# EAGLE design IMD_AMS_Latch (EAGLE 9.2.2)
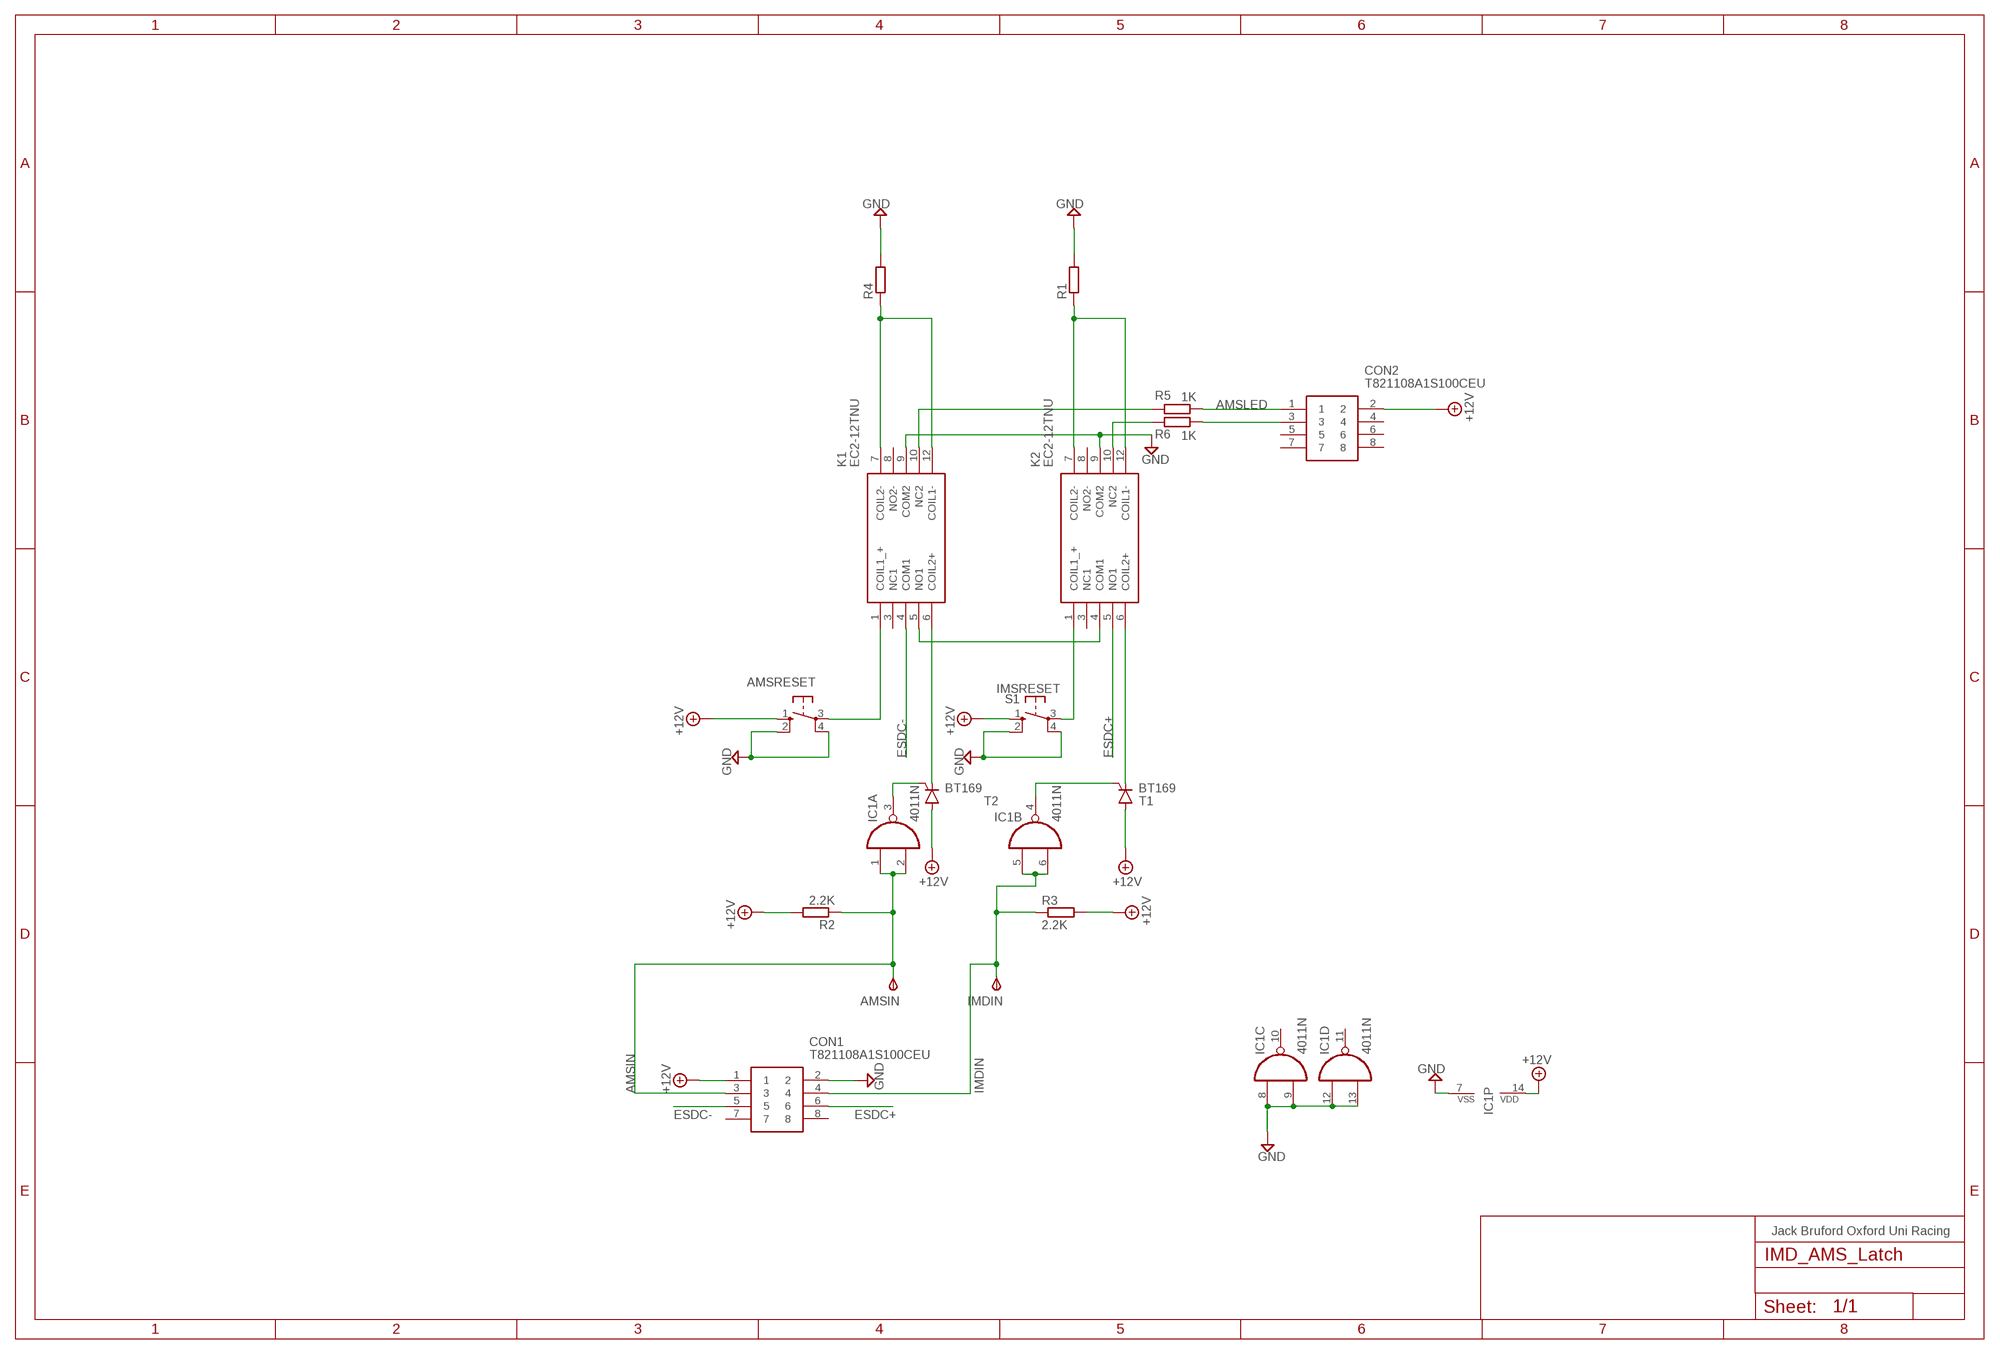
[diagram p0: schematic, sheet 1]

## Parts
AMSIN  TPSPAD1-13  [P1-13]
AMSRESET  10-XX  [B3F-10XX]
CON1  T821108A1S100CEU  [HDRV8W64P254_2X4_1778X895X915P]
CON2  T821108A1S100CEU  [HDRV8W64P254_2X4_1778X895X915P]
IC1  4011N  [DIL14]
IMDIN  TPSPAD1-13  [P1-13]
K1  EC2-12TNU  [EC212TNU]
K2  EC2-12TNU  [EC212TNU]
R1  R-EU_0207/15  [0207/15]
R2  2.2K  R-EU_0207/15  [0207/15]
R3  2.2K  R-EU_0207/15  [0207/15]
R4  R-EU_0207/15  [0207/15]
R5  1K  R-EU_0207/15  [0207/15]
R6  1K  R-EU_0207/15  [0207/15]
S1  10-XX  [B3F-10XX]
T1  BT169  [TO92-2]
T2  BT169  [TO92-2]

## Nets
+12V: AMSRESET.1(S) CON1.1 CON2.2 IC1.14(P:VDD) R2.2 R3.2 S1.1(S) T1.A T2.A
AMSIN: AMSIN.TP(PP) CON1.3 IC1.1(A:I0) IC1.2(A:I1) R2.1
AMSLED: K1.10(NC2) R5.2
ESDC+: CON1.6 K2.5(NO1)
ESDC-: CON1.5 K1.4(COM1)
GND: AMSRESET.2(S1) AMSRESET.4(P1) CON1.2 IC1.7(P:VSS) IC1.8(C:I0) IC1.9(C:I1) IC1.12(D:I0) IC1.13(D:I1) K1.9(COM2) K2.9(COM2) R1.2 R4.2 S1.2(S1) S1.4(P1)
IMDIN: CON1.4 IC1.5(B:I0) IC1.6(B:I1) IMDIN.TP(PP) R3.1
IMSRESET: K1.5(NO1) K2.4(COM1)
N$1: AMSRESET.3(P) K1.1(COIL1_+)
N$2: K1.6(COIL2+) T2.C
N$3: K2.7(COIL2-) K2.12(COIL1-) R1.1
N$4: K2.6(COIL2+) T1.C
N$5: K2.1(COIL1_+) S1.3(P)
N$6: K1.7(COIL2-) K1.12(COIL1-) R4.1
N$7: K2.10(NC2) R6.2
N$8: CON2.1 R5.1
N$9: CON2.3 R6.1
N$10: IC1.3(A:O) T2.G
N$11: IC1.4(B:O) T1.G
Unconnected: CON1.7 CON1.8 CON2.4 CON2.5 CON2.6 CON2.7 CON2.8 IC1.10(C:O) IC1.11(D:O) K1.3(NC1) K1.8(NO2-) K2.3(NC1) K2.8(NO2-)

## Notes on the sheet
- Jack Bruford Oxford Uni Racing

## Library data of the parts
AMSIN IMDIN = testpad:TPS: TEST PIN
AMSRESET S1 = switch-omron:10-XX: OMRON SWITCH; MPN: B3F-1000; OC_FARNELL: 176432; OC_NEWARK: 36M3542
CON1 CON2 = T821108A1S100CEU:T821108A1S100CEU: HEADER, VERTICAL, 2.54MM, 8WAY Amphenol T821 Series, 2.54mm Pitch 8 Way 2 Row Straight PCB Header, Solder Termination, 3A Source: Datasheet <http://uk.rs-online.com/web/p/products/1702738>; DESCRIPTION: HEADER, VERTICAL, 2.54MM, 8WAY Amphenol T821 Series, 2.54mm Pitch 8 Way 2 Row Straight PCB Header, Solder Termination, 3A; HEIGHT: 9.15mm; MANUFACTURER_NAME: Amphenol; MANUFACTURER_PART_NUMBER: T821108A1S100CEU; RS_PART_NUMBER: 1702738
IC1 = 40xx:4011: Quad 2-input NAND
K1 K2 = SamacSys_Parts:EC2-12TNU: DPDT Through Hole Latching Relay, 2 A, 12V dc Source: Datasheet <https://componentsearchengine.com/Datasheets/1/EC2-12TNU.pdf>; DESCRIPTION: DPDT Through Hole Latching Relay, 2 A, 12V dc; HEIGHT: 9mm; MANUFACTURER_NAME: Kemet; MANUFACTURER_PART_NUMBER: EC2-12TNU; MOUSER_PART_NUMBER: 80-EC2-12TNU
R1-R6 = rcl:R-EU_: RESISTOR, European symbol; SPICEPREFIX: R
T1 T2 = triac:BT169: THYRISTOR

## Board
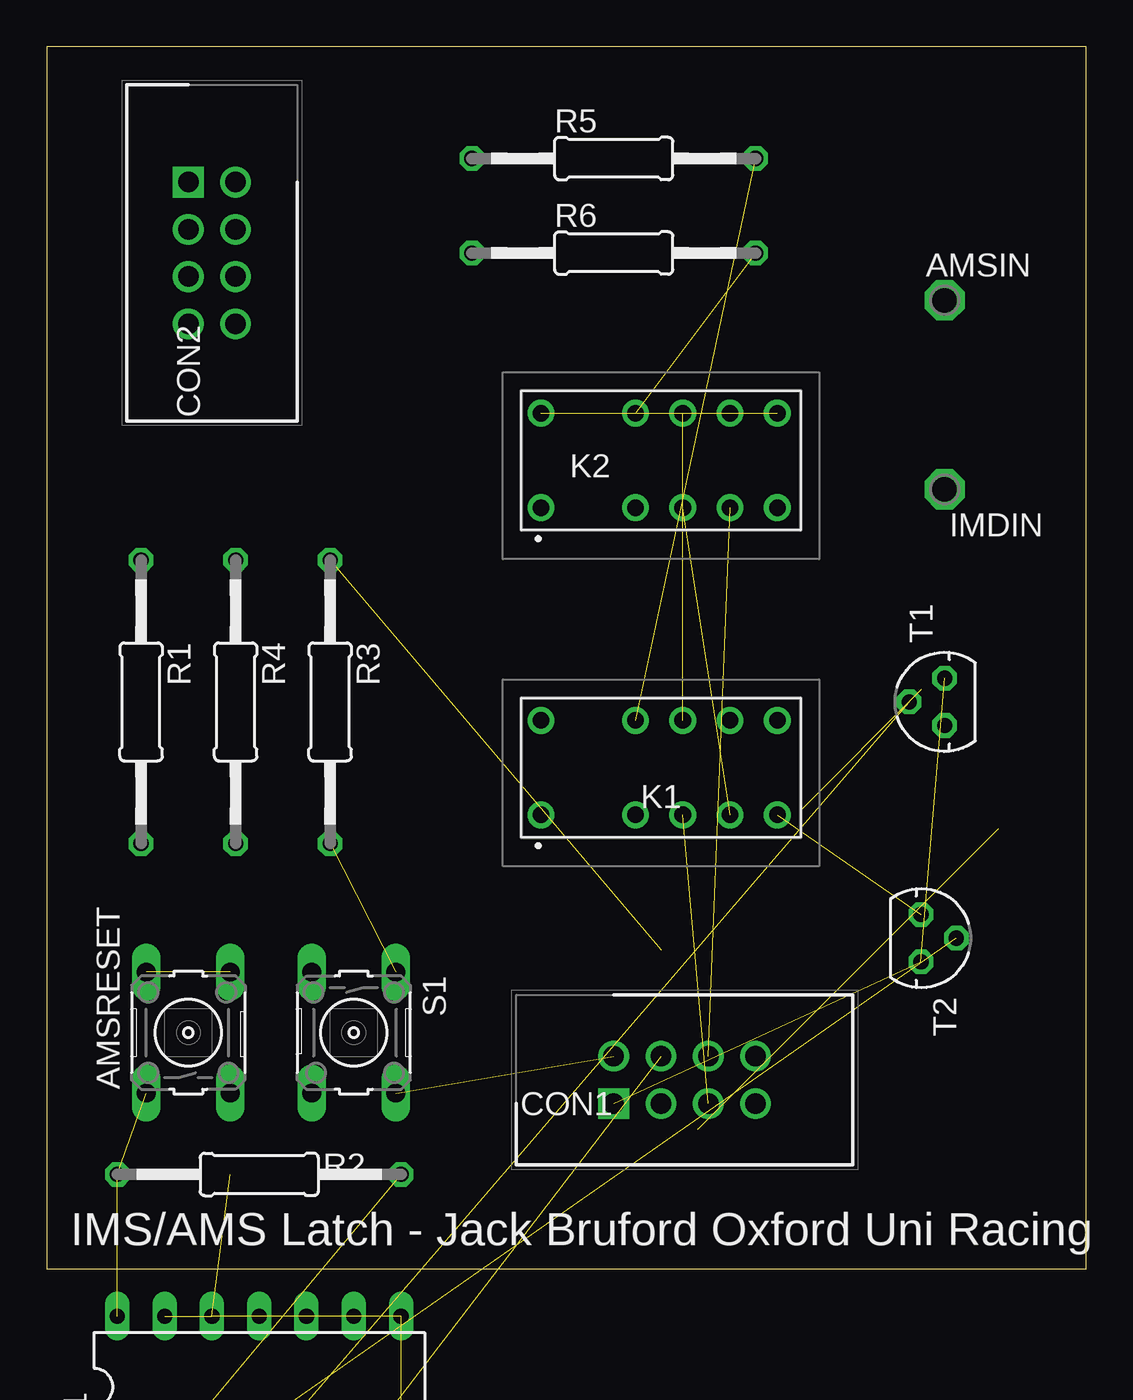
[diagram p1: board, top side]
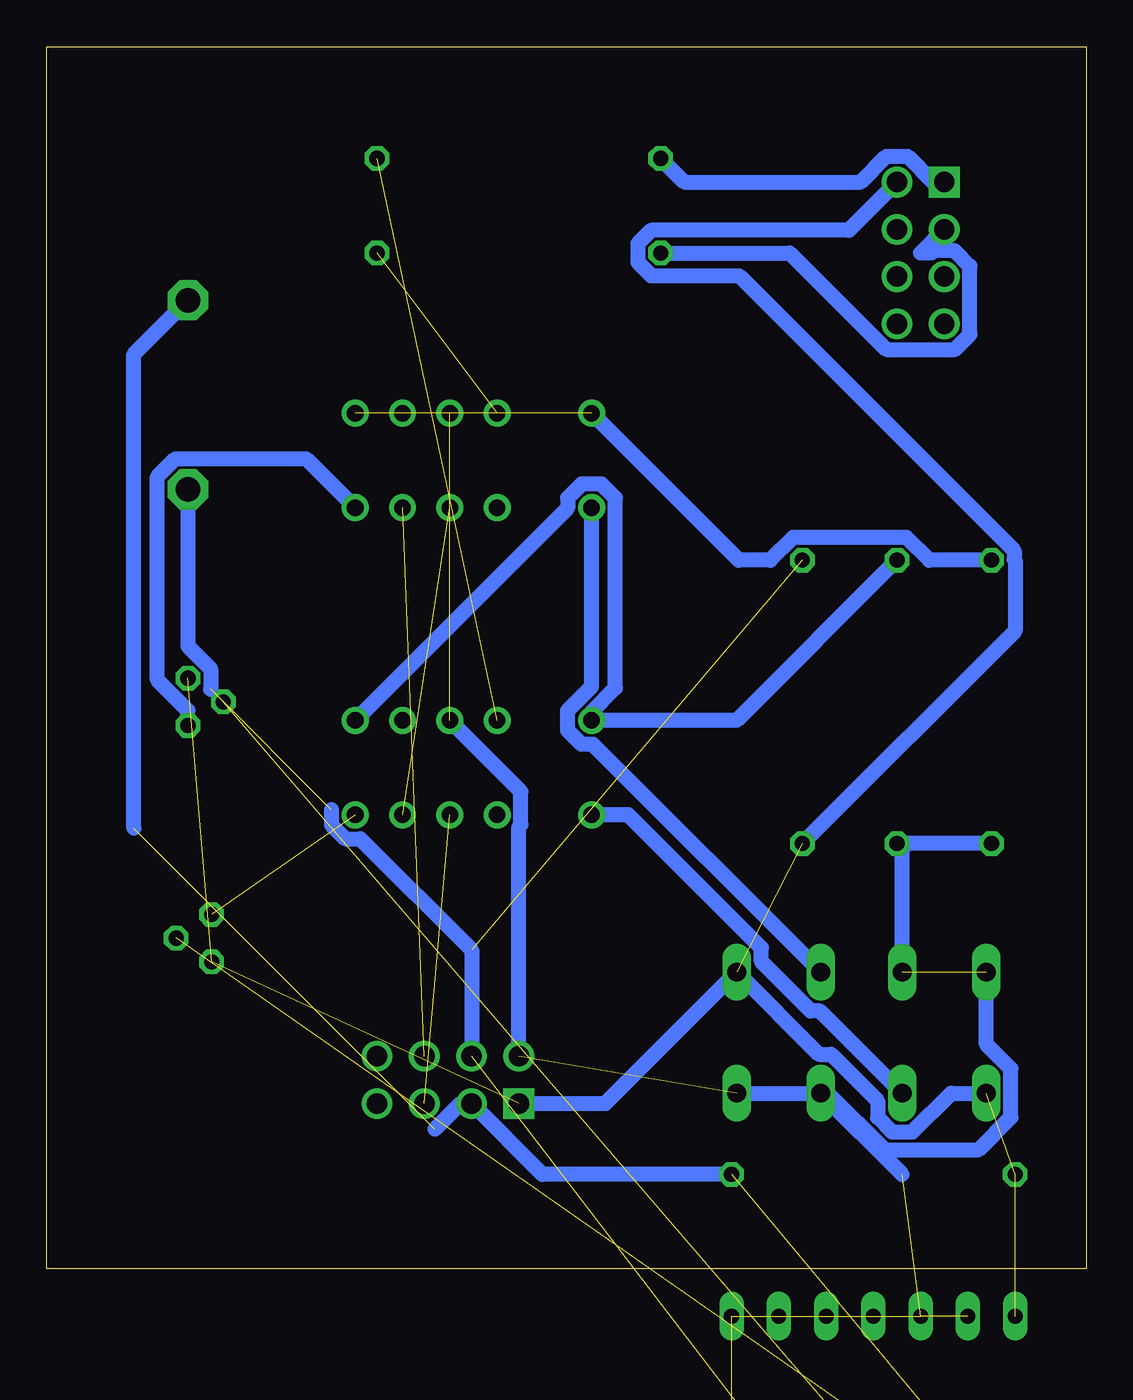
[diagram p2: board, bottom side, seen from below]

Size 55.86 x 65.71 mm. Coordinates in mm from the lower left corner, seen from the top.
Outline: 0,0 55.86,0 55.86,65.71 0,65.71 0,0
Copper layers (1*16): Top 0.035mm / dielectric 1.5mm / Bottom 0.035mm
Design rules "default": minimum track width 6mil, minimum drill 0.35mm, track to track 6mil, track to pad 6mil, pad to pad 6mil, via to via 6mil, smd to smd 6mil, copper to edge 40mil, drill to drill 6mil, minimum pad ring 10mil, minimum via ring 8mil, stop-mask expansion 4mil, vias tented up to drill 0mil, thermal gap 10mil

### Footprints (pad centres in the part's own frame; a part is rotated, then mirrored left to right if it is on the bottom)
P1-13 = drill 1.321 pad 2.159 octagon: TP 0,0
B3F-10XX = drill 1.016 long: 1 -3.251,2.261; 2 3.251,2.261; 3 -3.251,-2.261; 4 3.251,-2.261
HDRV8W64P254_2X4_1778X895X915P = drill 1.1 pad 1.65 square: 1 0,0 | drill 1.1 pad 1.65: 2 0,2.54; 3 2.54,0; 4 2.54,2.54; 5 5.08,0; 6 5.08,2.54; 7 7.62,0; 8 7.62,2.54
DIL14 = drill 0.813 long: 1 -7.62,-3.81; 2 -5.08,-3.81; 3 -2.54,-3.81; 4 0,-3.81; 5 2.54,-3.81; 6 5.08,-3.81; 7 7.62,-3.81; 8 7.62,3.81; 9 5.08,3.81; 10 2.54,3.81; 11 0,3.81; 12 -2.54,3.81; 13 -5.08,3.81; 14 -7.62,3.81
EC212TNU = drill 0.89 pad 1.446: 1 -6.45,-2.265; 3 -1.37,-2.265; 4 1.17,-2.265; 5 3.71,-2.265; 6 6.25,-2.265; 7 6.25,2.815; 8 3.71,2.815; 9 1.17,2.815; 10 -1.37,2.815; 12 -6.45,2.815
0207/15 = drill 0.813 octagon: 1 -7.62,0; 2 7.62,0
TO92-2 = drill 0.813 octagon: A 1.27,0; C -1.27,0; G 0,1.905

### Placement (x,y rotation side)
AMSIN  48.26,52.07 0 top
AMSRESET  7.62,12.7 90 top
CON1  30.48,8.89 0 top
CON2  7.62,58.42 270 top
IC1  11.43,-6.35 0 top
IMDIN  48.26,41.91 0 top
K1  33.02,26.67 0 top
K2  33.02,43.18 0 top
R1  5.08,30.48 270 top
R2  11.43,5.08 180 top
R3  15.24,30.48 270 top
R4  10.16,30.48 270 top
R5  30.48,59.69 0 top
R6  30.48,54.61 0 top
S1  16.51,12.7 270 top
T1  48.26,30.48 90 top
T2  46.99,17.78 270 top

### Tracks (layer width: path | path; a pad name or v marks a point on that pad's centre or on a via)
+12V  (5 unrouted)
  Bottom 0.813: CON1.1 25.83,8.89 S1.1 14.35,11.53 13.7,11.53 11.2,9.03 11.2,8.14 10.43,7.37 9.33,7.37 7.25,9.45 AMSRESET.1 | CON2.2 12.75,55.83 23.36,55.83 24.08,55.12 24.08,54.1 23.36,53.39 18.65,53.39 3.86,38.6 3.86,38.15 3.81,38.1 3.81,34.29 R3.2
AMSIN  (3 unrouted)
  Bottom 0.813: R2.1 29.21,5.08 CON1.3 33.6,8.89 34.99,7.51 | AMSIN.TP 51.17,49.16 51.17,23.68
AMSLED  (1 unrouted)
ESDC+  (1 unrouted)
ESDC-  (1 unrouted)
GND  (8 unrouted)
  Bottom 0.813: 9.88,5.08 S1.4 | S1.2 S1.4 | S1.4 13.88,9.45 10.83,6.4 5.78,6.4 4.04,8.14 4.04,10.76 5.36,12.08 AMSRESET.2 | AMSRESET.4 9.88,22.58 | 9.88,22.58 R4.2 | R1.2 9.6,22.86 9.88,22.58 | CON1.2 30.48,23.76 30.37,23.87 30.37,25.66 K1.9
IMDIN  (4 unrouted)
  Bottom 0.813: IMDIN.TP 48.26,33.47 47.04,32.26 47.04,31.17 | CON1.4 33.02,17.14 39,23.12 39.8,23.12 40.55,23.87 40.55,24.68
IMSRESET  (1 unrouted)
N$1
  Bottom 0.813: AMSRESET.3 14.3,13.87 14.8,13.87 17.45,16.52 17.45,17.26 24.59,24.41 K1.1
N$2  (1 unrouted)
N$3  (1 unrouted)
  Bottom 0.813: K2.12 18.68,38.1 16.96,38.1 15.74,39.32 9.65,39.32 8.44,38.1 R1.1
N$4
  Bottom 0.813: T1.C 48.26,30.03 49.9,31.66 49.9,42.59 48.94,43.55 41.9,43.55 K2.6
N$5
  Bottom 0.813: K2.1 26.57,31.3 27.85,30.02 27.85,28.95 27.1,28.2 26.5,28.2 S1.3
N$6
  Bottom 0.813: R4.1 18.77,29.48 K1.12 26.57,29.93 25.29,31.21 25.29,41.45 26.04,42.2 27.1,42.2 27.85,41.45 27.85,40.9 K1.7
N$7  (1 unrouted)
N$8
  Bottom 0.813: R5.1 21.59,58.42 12.12,58.42 10.73,59.8 9.59,59.8 8.2,58.42 CON2.1
N$9
  Bottom 0.813: CON2.3 8.89,54.61 8.31,54.61 8.19,54.72 7.05,54.72 6.24,53.91 6.24,50.23 7.05,49.42 10.73,49.42 15.93,54.61 R6.1
N$10  (1 unrouted)
N$11  (1 unrouted)

### Text on the board
tNames: IMS/AMS Latch - Jack Bruford Oxford Uni Racing